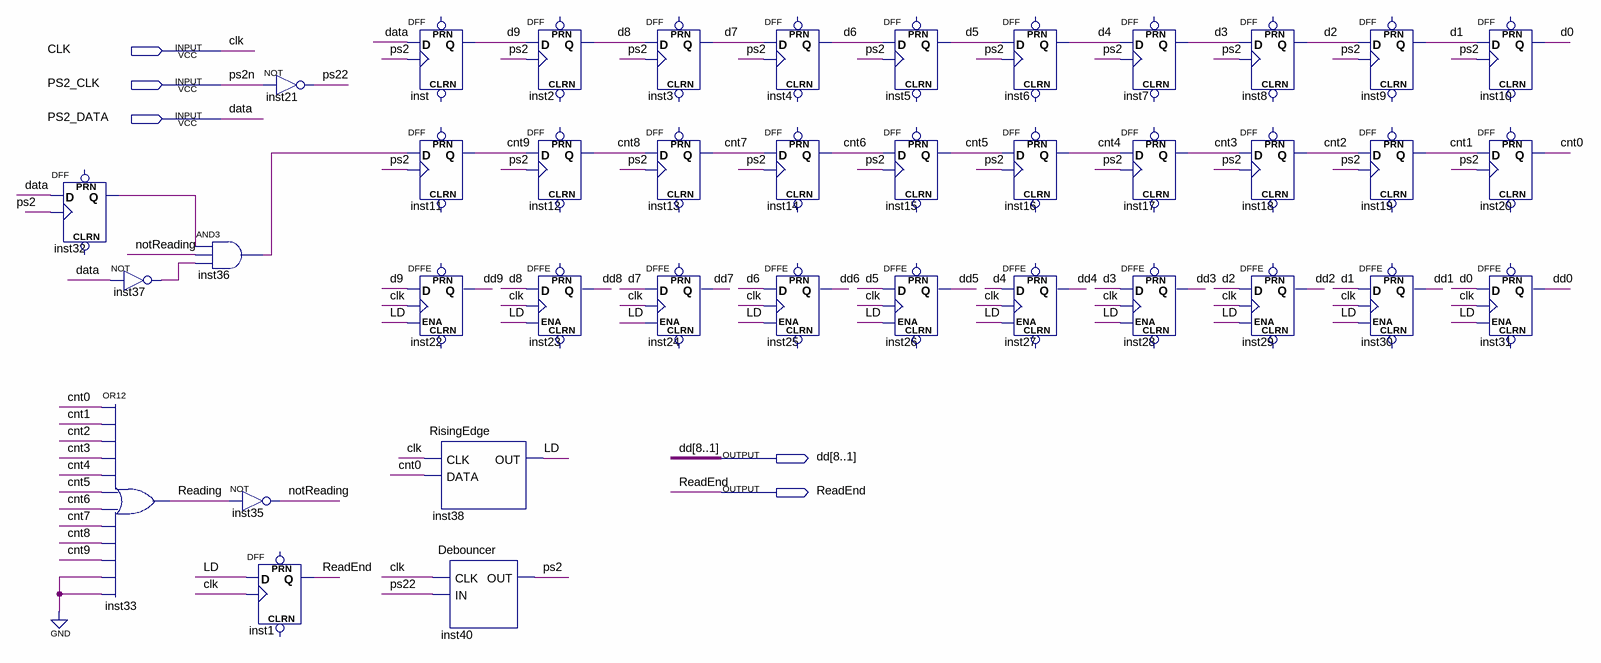
[diagram p0: schematic sheet]
// Quartus schematic PS2.bdf as structural Verilog: 39 symbols, 5 pins
module PS2 (
  input  CLK,
  input  PS2_CLK,
  input  PS2_DATA,
  output [8:1] dd,
  output ReadEnd
);

  wire cnt0, cnt1, cnt2, cnt3, cnt4, cnt5, cnt6, cnt7, cnt8, cnt9, d0, d1, d2, d3, d4, d5, d6, d7, d8, d9,
       dd0, dd9, inst32_q, inst36_out, inst37_out, LD, notReading, ps2, ps22, Reading;

  DFF inst32 (.CLK(ps2), .D(PS2_DATA), .Q(inst32_q));  // open: CLRN, PRN
  not inst37 (inst37_out, PS2_DATA);
  or inst33 (Reading, cnt0, cnt1, cnt2, cnt3, cnt4, cnt5, cnt6, cnt7, cnt8, cnt9, 1'b0, 1'b0);
  and inst36 (inst36_out, inst32_q, notReading, inst37_out);
  not inst21 (ps22, PS2_CLK);
  not inst35 (notReading, Reading);
  DFF inst1 (.CLK(CLK), .D(LD), .Q(ReadEnd));  // open: CLRN, PRN
  DFF inst (.CLK(ps2), .D(PS2_DATA), .Q(d9));  // open: CLRN, PRN
  DFF inst11 (.CLK(ps2), .D(inst36_out), .Q(cnt9));  // open: CLRN, PRN
  DFFE inst22 (.D(d9), .CLK(CLK), .ENA(LD), .Q(dd9));  // open: PRN, CLRN
  RisingEdge inst38 (.CLK(CLK), .DATA(cnt0), .OUT(LD));
  Debouncer inst40 (.CLK(CLK), .IN(ps22), .OUT(ps2));
  DFF inst2 (.CLK(ps2), .D(d9), .Q(d8));  // open: CLRN, PRN
  DFF inst12 (.CLK(ps2), .D(cnt9), .Q(cnt8));  // open: CLRN, PRN
  DFFE inst23 (.D(d8), .CLK(CLK), .ENA(LD), .Q(dd[8]));  // open: PRN, CLRN
  DFF inst3 (.CLK(ps2), .D(d8), .Q(d7));  // open: CLRN, PRN
  DFF inst13 (.CLK(ps2), .D(cnt8), .Q(cnt7));  // open: CLRN, PRN
  DFFE inst24 (.D(d7), .CLK(CLK), .ENA(LD), .Q(dd[7]));  // open: PRN, CLRN
  DFF inst4 (.CLK(ps2), .D(d7), .Q(d6));  // open: CLRN, PRN
  DFF inst14 (.CLK(ps2), .D(cnt7), .Q(cnt6));  // open: CLRN, PRN
  DFFE inst25 (.D(d6), .CLK(CLK), .ENA(LD), .Q(dd[6]));  // open: PRN, CLRN
  DFF inst5 (.CLK(ps2), .D(d6), .Q(d5));  // open: CLRN, PRN
  DFF inst15 (.CLK(ps2), .D(cnt6), .Q(cnt5));  // open: CLRN, PRN
  DFFE inst26 (.D(d5), .CLK(CLK), .ENA(LD), .Q(dd[5]));  // open: PRN, CLRN
  DFF inst6 (.CLK(ps2), .D(d5), .Q(d4));  // open: CLRN, PRN
  DFF inst16 (.CLK(ps2), .D(cnt5), .Q(cnt4));  // open: CLRN, PRN
  DFFE inst27 (.D(d4), .CLK(CLK), .ENA(LD), .Q(dd[4]));  // open: PRN, CLRN
  DFF inst7 (.CLK(ps2), .D(d4), .Q(d3));  // open: CLRN, PRN
  DFF inst17 (.CLK(ps2), .D(cnt4), .Q(cnt3));  // open: CLRN, PRN
  DFFE inst28 (.D(d3), .CLK(CLK), .ENA(LD), .Q(dd[3]));  // open: PRN, CLRN
  DFF inst8 (.CLK(ps2), .D(d3), .Q(d2));  // open: CLRN, PRN
  DFF inst18 (.CLK(ps2), .D(cnt3), .Q(cnt2));  // open: CLRN, PRN
  DFFE inst29 (.D(d2), .CLK(CLK), .ENA(LD), .Q(dd[2]));  // open: PRN, CLRN
  DFF inst9 (.CLK(ps2), .D(d2), .Q(d1));  // open: CLRN, PRN
  DFF inst19 (.CLK(ps2), .D(cnt2), .Q(cnt1));  // open: CLRN, PRN
  DFFE inst30 (.D(d1), .CLK(CLK), .ENA(LD), .Q(dd[1]));  // open: PRN, CLRN
  DFF inst10 (.CLK(ps2), .D(d1), .Q(d0));  // open: CLRN, PRN
  DFF inst20 (.CLK(ps2), .D(cnt1), .Q(cnt0));  // open: CLRN, PRN
  DFFE inst31 (.D(d0), .CLK(CLK), .ENA(LD), .Q(dd0));  // open: PRN, CLRN

  // Other names for the same wires on the sheet: data = PS2_DATA; ps2n = PS2_CLK
endmodule
